# Altium schematic sheet Sheet_1-copy_2025-02-23.schdoc
size 307 x 191 mm
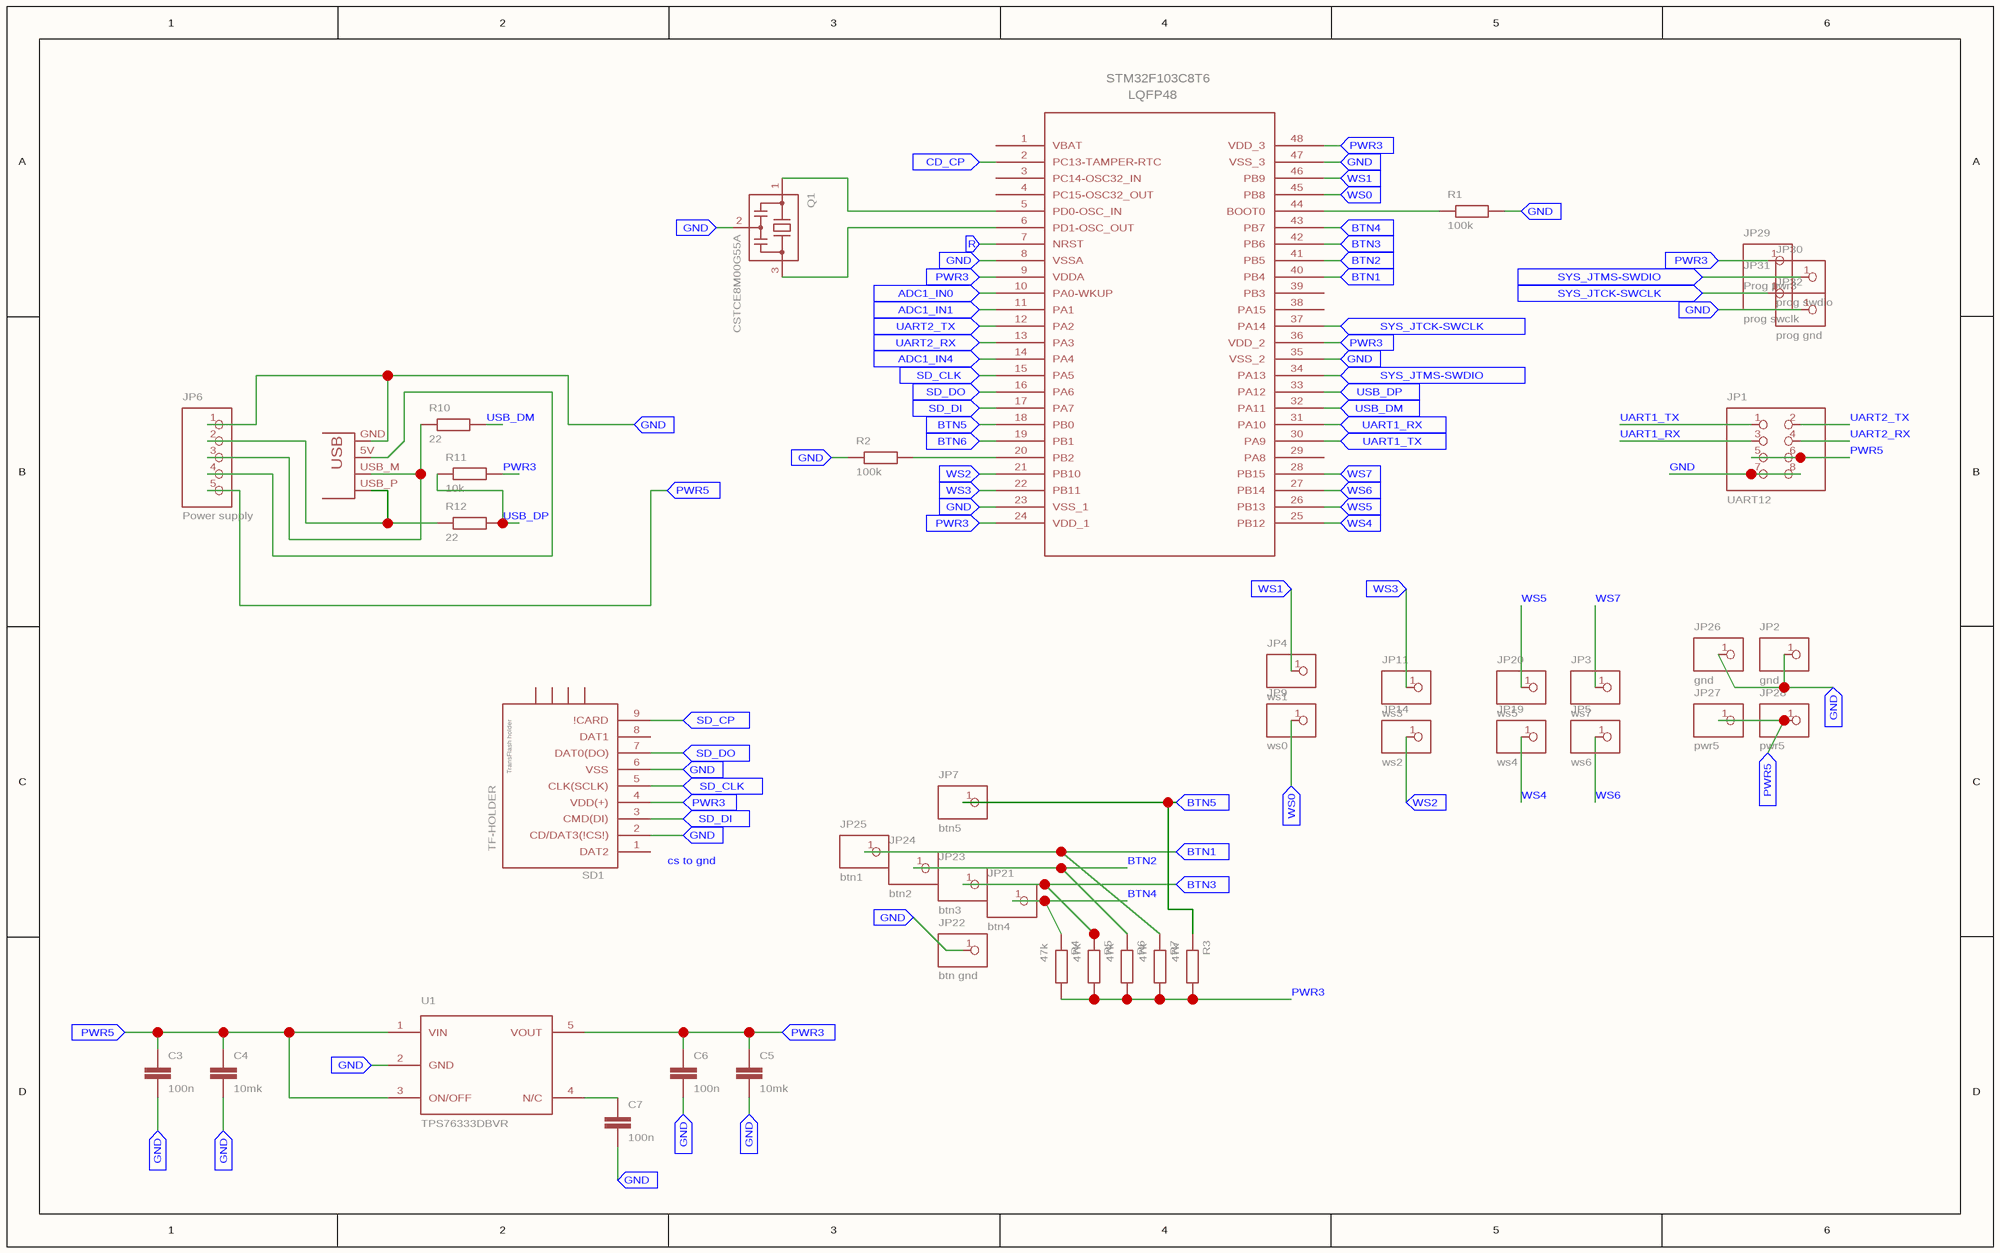
[diagram p0: Sheet_1-copy_2025-02-23.schdoc]

## Parts
C3  100n  [C0603]
C4  10mk  [C0805]
C5  10mk  [C0805]
C6  100n  [C0603]
C7  100n  [C0603]
JP1  UART12  [2X04]
JP2  gnd  [1X01]
JP3  ws7  [1X01]
JP4  ws1  [1X01]
JP5  ws6  [1X01]
JP6  Power supply  [1X05]
JP7  btn5  [1X01]
JP9  ws0  [1X01]
JP11  ws3  [1X01]
JP14  ws2  [1X01]
JP19  ws4  [1X01]
JP20  ws5  [1X01]
JP21  btn4  [1X01]
JP22  btn gnd  [1X01]
JP23  btn3  [1X01]
JP24  btn2  [1X01]
JP25  btn1  [1X01]
JP26  gnd  [1X01]
JP27  pwr5  [1X01]
JP28  pwr5  [1X01]
JP29  Prog pwr3  [1X01]
JP30  prog swdio  [1X01]
JP31  prog swclk  [1X01]
JP32  prog gnd  [1X01]
Q1  CSTCE8M00G55A  [CSTCE_G_A]
R1  100k  [R0805]
R2  100k  [R0805]
R3  47k  [R0805]
R4  47k  [R0805]
R5  47k  [R0805]
R6  47k  [R0805]
R7  47k  [R0805]
R10  22  [R0805]
R11  10k  [R0805]
R12  22  [R0805]
SD1  TF-HOLDER  [TF-PULL]
U1  TPS76333DBVR  [SOT23-5]
U$1  STM32F103C8T6  [LQFP-48]  (value not drawn)
X2  USBPCB  [USB-A-PCB]  (value not drawn)

## Ports
ADC1_IN0 (in), ADC1_IN1 (in), ADC1_IN4 (in), BTN1 (in), BTN2 (in), BTN3 (in), BTN4 (in), BTN5 (in), BTN6 (in), CD_CP (in), GND (in), PWR3 (in), PWR5 (in), R (in), SD_CLK (in), SD_CP (in), SD_DI (in), SD_DO (in), SYS_JTCK-SWCLK (in), SYS_JTMS-SWDIO (in), UART1_RX (in), UART1_TX (in), UART2_RX (in), UART2_TX (in), USB_DM (in), USB_DP (in), WS0 (in), WS1 (in), WS2 (in), WS3 (in), WS4 (in), WS5 (in), WS6 (in), WS7 (in)

## Nets
ADC1_IN0: U$1.10(PA0-WKUP) ; port ADC1_IN0
ADC1_IN1: U$1.11(PA1) ; port ADC1_IN1
ADC1_IN4: U$1.14(PA4) ; port ADC1_IN4
BTN1: JP25.1 R7.1 U$1.40(PB4) ; port BTN1
BTN2: U$1.41(PB5) ; port BTN2
BTN2: JP24.1 R6.1  [a separate net that carries the same name]
BTN3: JP23.1 R5.1 U$1.42(PB6) ; port BTN3
BTN4: U$1.43(PB7) ; port BTN4
BTN4: JP21.1 R4.1  [a separate net that carries the same name]
BTN5: JP7.1 R3.1 U$1.18(PB0) ; port BTN5
BTN6: U$1.19(PB1) ; port BTN6
CD_CP: U$1.2(PC13-TAMPER-RTC) ; port CD_CP
GND: C3.2 C4.2 C5.2 C6.2 C7.2 JP2.1 JP6.1 JP22.1 JP26.1 JP32.1 Q1.2 R1.2 R2.1 SD1.2(CD/DAT3(!CS!)) SD1.6(VSS) U1.2(GND) U$1.8(VSSA) U$1.23(VSS_1) U$1.35(VSS_2) U$1.47(VSS_3) X2.GND ; port GND
GND: JP1.7 JP1.8  [a separate net that carries the same name]
PWR3: C5.1 C6.1 JP29.1 SD1.4(VDD(+)) U1.5(VOUT) U$1.9(VDDA) U$1.24(VDD_1) U$1.36(VDD_2) U$1.48(VDD_3) ; port PWR3
PWR3: R3.2 R4.2 R5.2 R6.2 R7.2 R11.2  [a separate net that carries the same name]
PWR5: C3.1 C4.1 JP6.5 JP27.1 JP28.1 U1.1(VIN) U1.3(ON/OFF) ; port PWR5
PWR5: JP1.5 JP1.6  [a separate net that carries the same name]
R: U$1.7(NRST) ; port R
SD_CLK: SD1.5(CLK(SCLK)) U$1.15(PA5) ; port SD_CLK
SD_CP: SD1.9(!CARD) ; port SD_CP
SD_DI: SD1.3(CMD(DI)) U$1.17(PA7) ; port SD_DI
SD_DO: SD1.7(DAT0(DO)) U$1.16(PA6) ; port SD_DO
SYS_JTCK-SWCLK: JP31.1 U$1.37(PA14) ; port SYS_JTCK-SWCLK
SYS_JTMS-SWDIO: JP30.1 U$1.34(PA13) ; port SYS_JTMS-SWDIO
UART1_RX: U$1.31(PA10) ; port UART1_RX
UART1_RX: JP1.3  [a separate net that carries the same name]
UART1_TX: U$1.30(PA9) ; port UART1_TX
UART1_TX: JP1.1  [a separate net that carries the same name]
UART2_RX: U$1.13(PA3) ; port UART2_RX
UART2_RX: JP1.4  [a separate net that carries the same name]
UART2_TX: U$1.12(PA2) ; port UART2_TX
UART2_TX: JP1.2  [a separate net that carries the same name]
USB_DM: U$1.32(PA11) ; port USB_DM
USB_DM: R10.2  [a separate net that carries the same name]
USB_DP: U$1.33(PA12) ; port USB_DP
USB_DP: R11.1 R12.2  [a separate net that carries the same name]
WS0: JP9.1 U$1.45(PB8) ; port WS0
WS1: JP4.1 U$1.46(PB9) ; port WS1
WS2: JP14.1 U$1.21(PB10) ; port WS2
WS3: JP11.1 U$1.22(PB11) ; port WS3
WS4: U$1.25(PB12) ; port WS4
WS4: JP19.1  [a separate net that carries the same name]
WS5: U$1.26(PB13) ; port WS5
WS5: JP20.1  [a separate net that carries the same name]
WS6: U$1.27(PB14) ; port WS6
WS6: JP5.1  [a separate net that carries the same name]
WS7: U$1.28(PB15) ; port WS7
WS7: JP3.1  [a separate net that carries the same name]
NetC7_1: C7.1 U1.4(N/C)
NetJP6_2: JP6.2 R12.1 X2.USB_P(D+)
NetJP6_3: JP6.3 R10.1 X2.USB_M(D-)
NetJP6_4: JP6.4 X2.5V(VBUS)
NetQ1_1: Q1.1 U$1.5(PD0-OSC_IN)
NetQ1_3: Q1.3 U$1.6(PD1-OSC_OUT)
NetR1_1: R1.1 U$1.44(BOOT0)
NetR2_2: R2.2 U$1.20(PB2)

Not connected (* = marked no-connect by the designer): SD1 1(DAT2) 8(DAT1) S1 S2 S3 S4; U$1 1(VBAT) 3(PC14-OSC32_IN) 4(PC15-OSC32_OUT) 29(PA8) 38(PA15) 39(PB3)

## Notes on the sheet
- (near SD1) cs to gnd
- (in symbol STM32F103C8T6) LQFP48
- (in symbol TF-HOLDER) TransFlash holder
- (in symbol USBPCB) USB

## Library data of the parts
JP2 JP26 = gnd: Package Display: No
JP3 = ws7: Package Display: No
JP4 = ws1: Package Display: No
JP5 = ws6: Package Display: No
JP6 = Power supply: Package Display: No
JP7 = btn5: Package Display: No
JP9 = ws0: Package Display: No
JP11 = ws3: Package Display: No
JP14 = ws2: Package Display: No
JP19 = ws4: Package Display: No
JP20 = ws5: Package Display: No
JP21 = btn4: Package Display: No
JP22 = btn gnd: Package Display: No
JP23 = btn3: Package Display: No
JP24 = btn2: Package Display: No
JP25 = btn1: Package Display: No
JP27 JP28 = pwr5: Package Display: No
JP29 = Prog pwr3: Package Display: No
JP30 = prog swdio: Package Display: No
JP31 = prog swclk: Package Display: No
JP32 = prog gnd: Package Display: No
X2 = USBPCB: Package Display: No